# Altium schematic sheet MCU.SchDoc
size A2; SheetNumber: 2; SheetTotal: 2
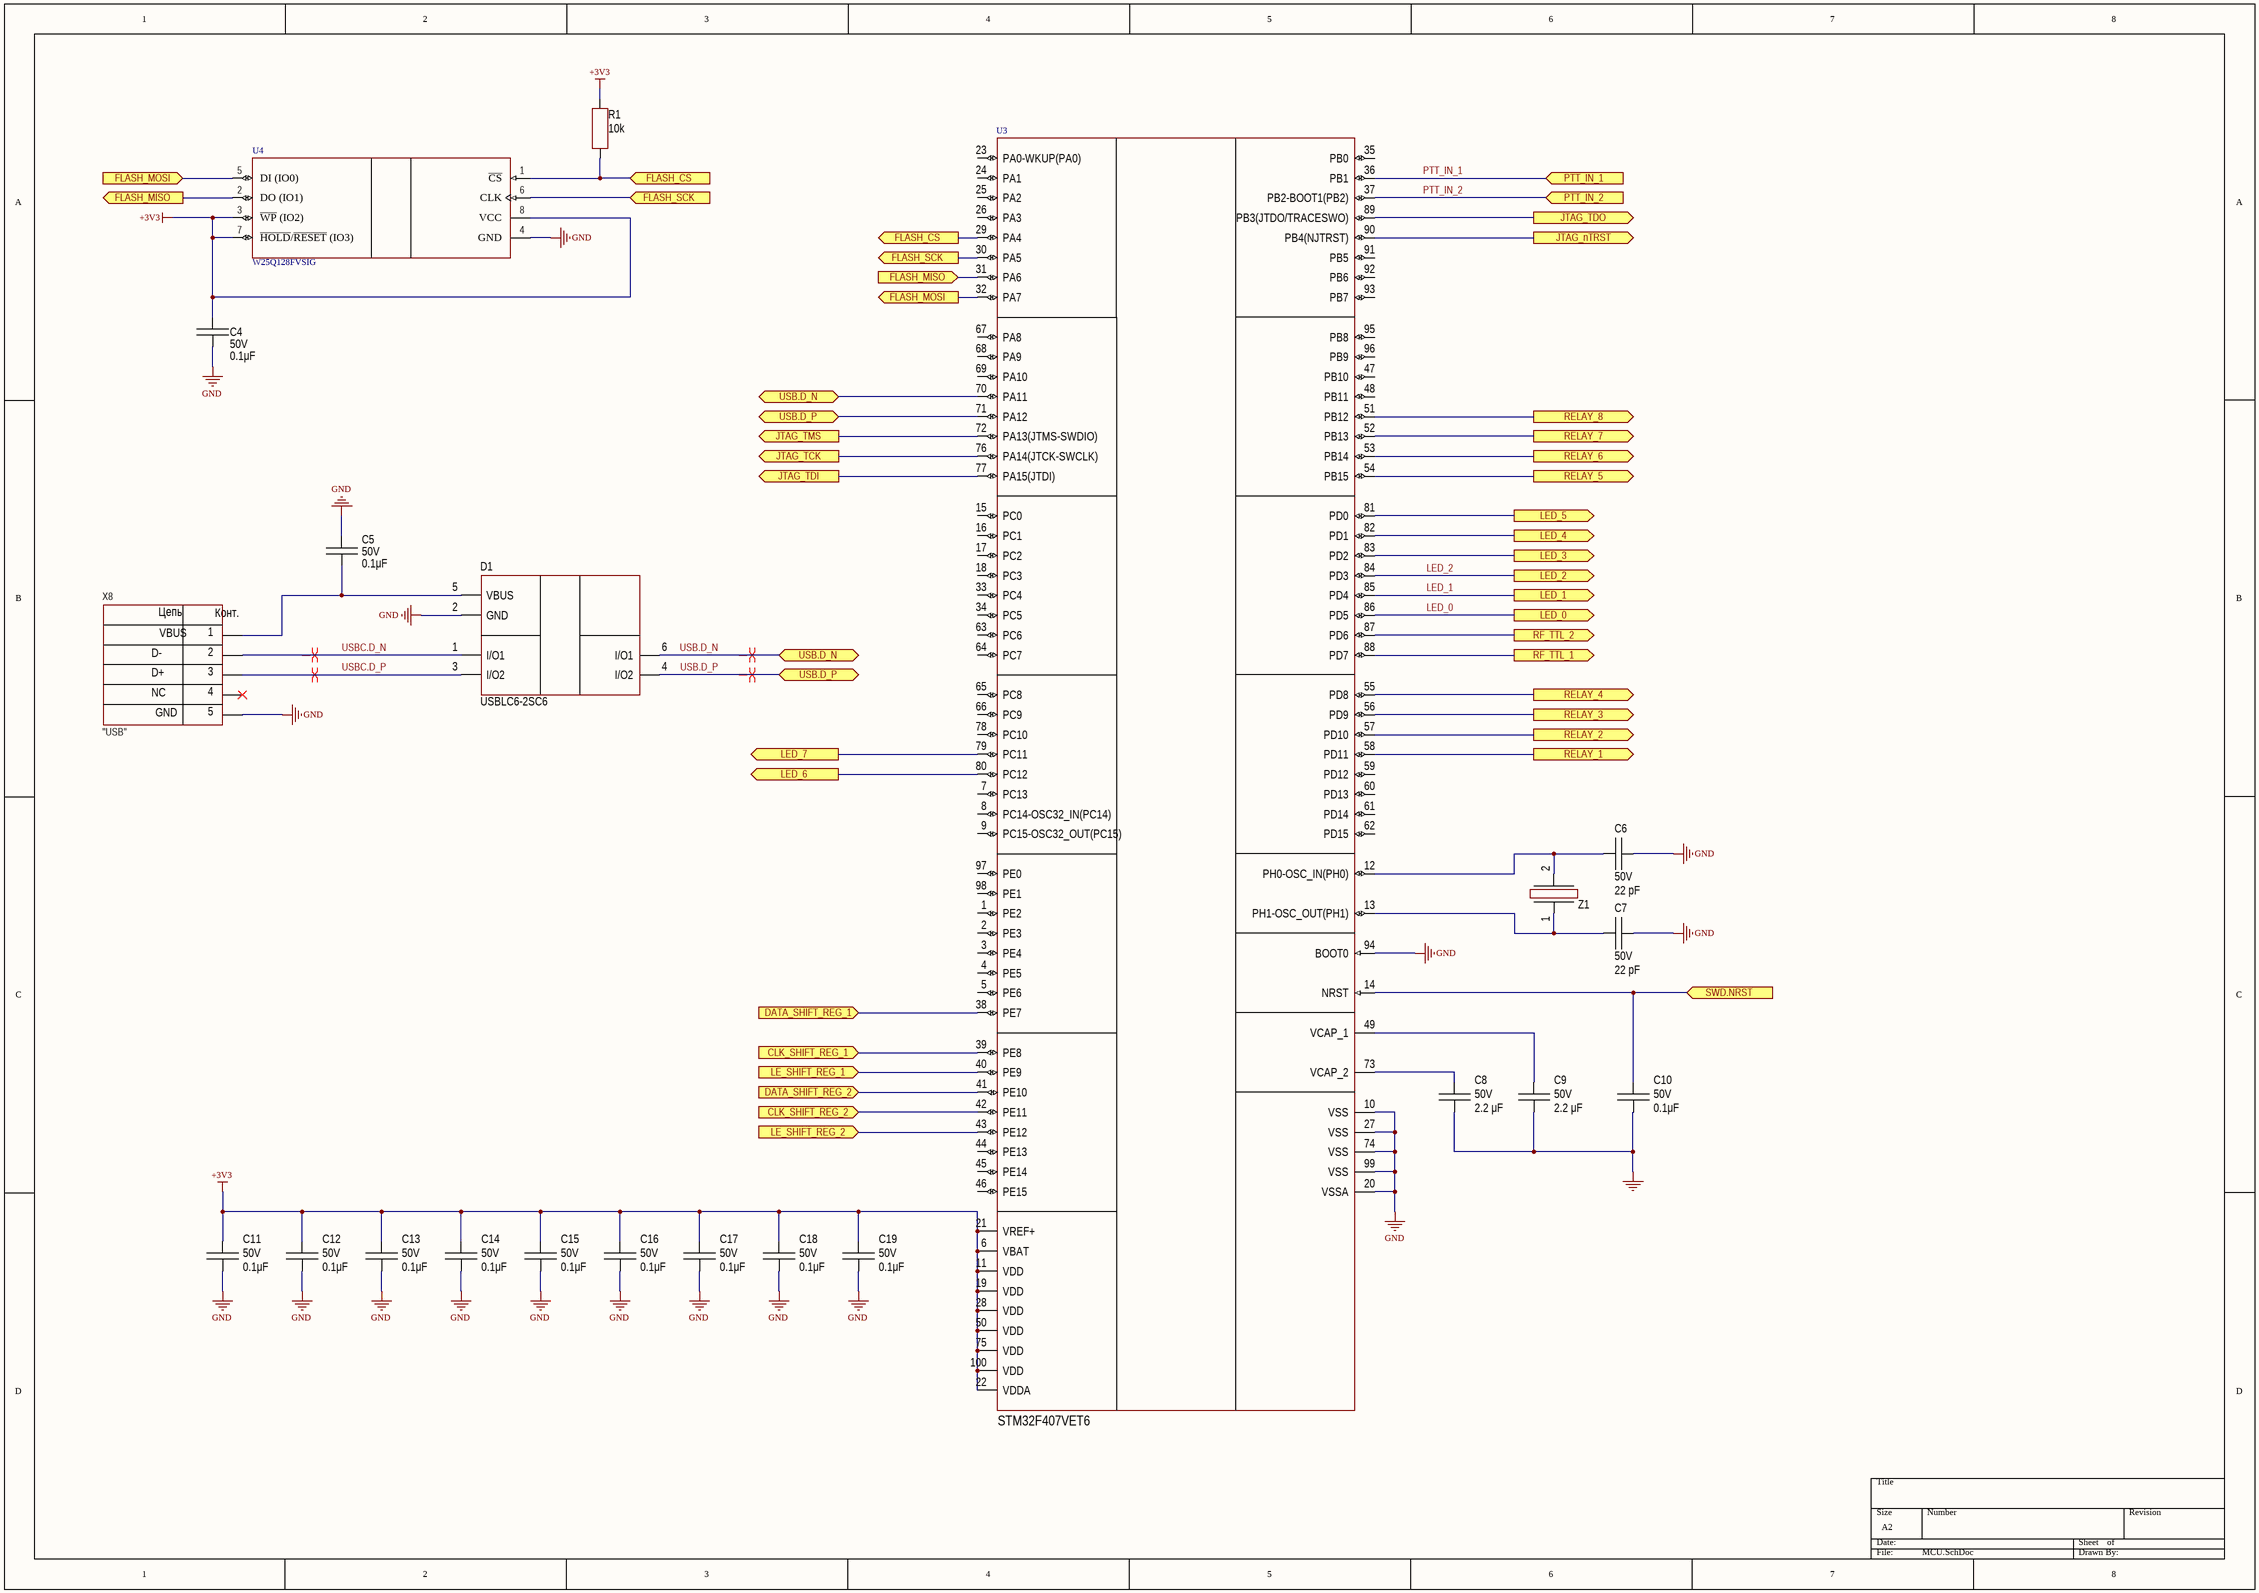
[diagram p0: MCU.SchDoc]

## Parts
C4  value 0.1μF  Voltage: 50V  [CAP: 1206]
C5  value 0.1μF  Voltage: 50V  [CAP: 1206]
C6  value 22 pF  Voltage: 50V  [CAP: 1206]
C7  value 22 pF  Voltage: 50V  [CAP: 1206]
C8  value 2.2 μF  Voltage: 50V  [CAP: 1206]
C9  value 2.2 μF  Voltage: 50V  [CAP: 1206]
C10  value 0.1μF  Voltage: 50V  [CAP: 1206]
C11  value 0.1μF  Voltage: 50V  [CAP: 1206]
C12  value 0.1μF  Voltage: 50V  [CAP: 1206]
C13  value 0.1μF  Voltage: 50V  [CAP: 1206]
C14  value 0.1μF  Voltage: 50V  [CAP: 1206]
C15  value 0.1μF  Voltage: 50V  [CAP: 1206]
C16  value 0.1μF  Voltage: 50V  [CAP: 1206]
C17  value 0.1μF  Voltage: 50V  [CAP: 1206]
C18  value 0.1μF  Voltage: 50V  [CAP: 1206]
C19  value 0.1μF  Voltage: 50V  [CAP: 1206]
D1  (no value)  [SOT23-6]
R1  value 10k  [RES: 1206]
U3  STM32F407VET6  [STM-LQFP100_V]
U4  W25Q128FVSIG  [8-SOIC]
X8  CommentText: "USB"  [CON: 0675031020]
Z1  (no value)  [CTS-ATS-SM-XTAL-2]

## Ports
CLK_SHIFT_REG_1 (in), CLK_SHIFT_REG_2 (in), DATA_SHIFT_REG_1 (in), DATA_SHIFT_REG_2 (in), FLASH_CS (in), FLASH_CS (out), FLASH_MISO (in), FLASH_MISO (out), FLASH_MOSI (in), FLASH_MOSI (out), FLASH_SCK (in), FLASH_SCK (out), JTAG_nTRST (out), JTAG_TCK (out), JTAG_TDI (out), JTAG_TDO (out), JTAG_TMS (out), LE_SHIFT_REG_1 (in), LE_SHIFT_REG_2 (in), LED_0 (out), LED_1 (out), LED_2 (out), LED_3 (out), LED_4 (out), LED_5 (out), LED_6 (out), LED_7 (out), PTT_IN_1 (in), PTT_IN_2 (in), RELAY_1 (out), RELAY_2 (out), RELAY_3 (out), RELAY_4 (out), RELAY_5 (out), RELAY_6 (out), RELAY_7 (out), RELAY_8 (out), RF_TTL_1 (out), RF_TTL_2 (out), SWD.NRST (in), USB.D_N (bidir), USB.D_P (bidir)

## Nets
+3V3: C4.1 C11.2 C12.2 C13.2 C14.2 C15.2 C16.2 C17.2 C18.2 C19.2 R1.1 U3.6(VBAT) U3.11(VDD) U3.19(VDD) U3.21(VREF+) U3.22(VDDA) U3.28(VDD) U3.50(VDD) U3.75(VDD) U3.100(VDD) U4.3(~{WP}_(IO2)) U4.7(~{HOLD}/~{RESET}_(IO3)) U4.8(VCC)
GND: C4.2 C5.1 C6.1 C7.1 C8.1 C9.1 C10.1 C11.1 C12.1 C13.1 C14.1 C15.1 C16.1 C17.1 C18.1 C19.1 D1.2(GND) U3.10(VSS) U3.20(VSSA) U3.27(VSS) U3.74(VSS) U3.94(BOOT0) U3.99(VSS) U4.4(GND) X8.5
CLK_SHIFT_REG_1: U3.39(PE8) ; port CLK_SHIFT_REG_1
CLK_SHIFT_REG_2: U3.42(PE11) ; port CLK_SHIFT_REG_2
DATA_SHIFT_REG_1: U3.38(PE7) ; port DATA_SHIFT_REG_1
DATA_SHIFT_REG_2: U3.41(PE10) ; port DATA_SHIFT_REG_2
FLASH_CS: R1.2 U3.29(PA4) U4.1(~{CS}) ; port FLASH_CS
FLASH_MISO: U3.31(PA6) U4.2(DO_(IO1)) ; port FLASH_MISO
FLASH_MOSI: U3.32(PA7) U4.5(DI_(IO0)) ; port FLASH_MOSI
FLASH_SCK: U3.30(PA5) U4.6(CLK) ; port FLASH_SCK
JTAG_nTRST: U3.90(PB4(NJTRST)) ; port JTAG_nTRST
JTAG_TCK: U3.76(PA14(JTCK-SWCLK)) ; port JTAG_TCK
JTAG_TDI: U3.77(PA15(JTDI)) ; port JTAG_TDI
JTAG_TDO: U3.89(PB3(JTDO/TRACESWO)) ; port JTAG_TDO
JTAG_TMS: U3.72(PA13(JTMS-SWDIO)) ; port JTAG_TMS
LE_SHIFT_REG_1: U3.40(PE9) ; port LE_SHIFT_REG_1
LE_SHIFT_REG_2: U3.43(PE12) ; port LE_SHIFT_REG_2
LED_0: U3.86(PD5) ; port LED_0
LED_1: U3.85(PD4) ; port LED_1
LED_2: U3.84(PD3) ; port LED_2
LED_3: U3.83(PD2) ; port LED_3
LED_4: U3.82(PD1) ; port LED_4
LED_5: U3.81(PD0) ; port LED_5
LED_6: U3.80(PC12) ; port LED_6
LED_7: U3.79(PC11) ; port LED_7
PTT_IN_1: U3.36(PB1) ; port PTT_IN_1
PTT_IN_2: U3.37(PB2-BOOT1(PB2)) ; port PTT_IN_2
RELAY_1: U3.58(PD11) ; port RELAY_1
RELAY_2: U3.57(PD10) ; port RELAY_2
RELAY_3: U3.56(PD9) ; port RELAY_3
RELAY_4: U3.55(PD8) ; port RELAY_4
RELAY_5: U3.54(PB15) ; port RELAY_5
RELAY_6: U3.53(PB14) ; port RELAY_6
RELAY_7: U3.52(PB13) ; port RELAY_7
RELAY_8: U3.51(PB12) ; port RELAY_8
RF_TTL_1: U3.88(PD7) ; port RF_TTL_1
RF_TTL_2: U3.87(PD6) ; port RF_TTL_2
SWD.NRST: C10.2 U3.14(NRST) ; port SWD.NRST
USB.D_N: D1.6(I/O1) U3.70(PA11) ; port USB.D_N
USB.D_P: D1.4(I/O2) U3.71(PA12) ; port USB.D_P
USBC.D_N: D1.1(I/O1) X8.2
USBC.D_P: D1.3(I/O2) X8.3
NetC5_2: C5.2 D1.5(VBUS) X8.1
NetC6_2: C6.2 U3.12(PH0-OSC_IN(PH0)) Z1.2
NetC7_2: C7.2 U3.13(PH1-OSC_OUT(PH1)) Z1.1
NetC8_2: C8.2 U3.73(VCAP_2)
NetC9_2: C9.2 U3.49(VCAP_1)

Not connected (* = marked no-connect by the designer): U3 1(PE2) 2(PE3) 3(PE4) 4(PE5) 5(PE6) 7(PC13) 8(PC14-OSC32_IN(PC14)) 9(PC15-OSC32_OUT(PC15)) 15(PC0) 16(PC1) 17(PC2) 18(PC3) 23(PA0-WKUP(PA0)) 24(PA1) 25(PA2) 26(PA3) 33(PC4) 34(PC5) 35(PB0) 44(PE13) 45(PE14) 46(PE15) 47(PB10) 48(PB11) 59(PD12) 60(PD13) 61(PD14) 62(PD15) 63(PC6) 64(PC7) 65(PC8) 66(PC9) 67(PA8) 68(PA9) 69(PA10) 78(PC10) 91(PB5) 92(PB6) 93(PB7) 95(PB8) 96(PB9) 97(PE0) 98(PE1); X8 4*

## Layout directives
differential pair: USB.D_N, USB.D_P, USBC.D_N, USBC.D_P

## Notes on the sheet
- (in symbol Connector_USB_mini_B) Цепь; Конт.; VBUS; D-; D+; NC; GND

## Library data of the parts
C4 C5 C10-C19 = Ceramic_1206: Manufacturer: Yageo; PartNumber: CC1206KRX7R9BB104; ValueManufacturerPartNumber: Ceramic capacitor, 0.1μF, X7R, ±10%, 50V, 1206, -55...+125°C; TypeCapacitor: Ceramic capacitor; Tolerance: ±10%; TypeDielectric: X7R; Package: 1206; HelpURL: https://www.digikey.com/product-detail/en/yageo/CC1206KRX7R9BB104/311-1179-1-ND/303089; Temperature: -55...+125°C
C6 C7 = Ceramic_1206: Manufacturer: Yageo; PartNumber: CC1206KRX7R9BB104; ValueManufacturerPartNumber: Ceramic capacitor, 22 pF, X7R, ±10%, 50V, 1206, -55...+125°C; TypeCapacitor: Ceramic capacitor; Tolerance: ±10%; TypeDielectric: X7R; Package: 1206; HelpURL: https://www.digikey.com/product-detail/en/yageo/CC1206KRX7R9BB104/311-1179-1-ND/303089; Temperature: -55...+125°C
C8 C9 = Ceramic_1206: Manufacturer: Yageo; PartNumber: CC1206KRX7R9BB104; ValueManufacturerPartNumber: Ceramic capacitor, 2.2 μF, X7R, ±10%, 50V, 1206, -55...+125°C; TypeCapacitor: Ceramic capacitor; Tolerance: ±10%; TypeDielectric: X7R; Package: 1206; HelpURL: https://www.digikey.com/product-detail/en/yageo/CC1206KRX7R9BB104/311-1179-1-ND/303089; Temperature: -55...+125°C
D1 = USBLC6-2SC6: Manufacturer: STMicroelectronics; TypeDiode: USB protection; Current: 5A peak; VoltageDrop: 17V; RecoveryTime: Power line; Package: SOT-23-6; HelpURL: https://www.digikey.com/product-detail/en/stmicroelectronics/USBLC6-2SC6/497-5235-1-ND/1121688; ValueManufacturerPartNumber: =TypeDiode+', '+Voltage+', '+Current+', '+VoltageDrop+', '+RecoveryTime+', '+Package+', '+Temperature; Temperature: -40...+125°C; PartNumber: USBLC6-2SC6
R1 = Resistor_1206: Manufacturer: Yageo; PartNumber: RC1206JR-07100RL; TypeResistor: Resistor film; Power: 0.25W; Package: 1206; HelpURL: https://www.digikey.com/product-detail/en/yageo/RC1206JR-07100RL/311-100ERCT-ND/732153; ValueManufacturerPartNumber: =TypeResistor+', '+Value+', '+Tolerance+', '+Package+', '+Power+', '+Temperature; Temperature: -55...+125°C
U3 = CMP-0243-00016-3: ARM Cortex-M4 32-bit MCU+FPU, 210 DMIPS, 512 kB Flash, 192 kB Internal RAM, 82 I/Os, 100-pin LQFP, -40 to 85 degC, Tray; Manufacturer: STMicroelectronics; Supply Voltage(Vcc) max (V): 3.6; Supply Voltage(Vcc) min (V): 1.8; I/Os (High Current): 82; FLASH Size (Prog) (kB): 512; Operating Frequency(F) (Processor speed) (MHz): 168; D/A Converter: 2x12-bit; Internal RAM Size (kB): 192; PackageReference: LQFP100; Core: ARM Cortex-M4; ComponentLink1URL: http://www.st.com/web/en/home.html; ComponentLink1Description: Manufacturer URL; DatasheetVersion: Rev. 4; Packing: Tray; Mounting Technology: Surface Mount; ComponentLink2Description: Datasheet; ComponentLink2URL: http://www.st.com/st-web-ui/static/active/en/resource/technical/document/datasheet/DM00037051.pdf; ComponentLink3Description: Package Specification; PartNumber: STM32F407VET6; PackageVersion: Rev. 1, 06/2013; PackageDescription: 100-Pin Low Profile Quad Flat Package, 14 x 14 mm Body, 0.5 mm Pitch; ComponentLink3URL: http://www.st.com/st-web-ui/static/active/en/resource/technical/document/data_brief/DM00071938.pdf
U4 = CMP-2000-05005-1: 3V 128M-Bit Serial Flash Memory with Dual/Quad SPI & QPI, 2.7 to 3.6 V, -40 to 85 degC, 8-Pin SOIC, RoHS, Tape and Reel; Manufacturer: Winbond; Number of Words: 16777216; Address Bus: 24b; Word Size: 8b; Boot Type: NotRequired; Supply Current: 20mA; Operating Supply Voltage (Max): 3.6V; Sync/Async: Synchronous; Rad Hardened: No; Interface Type: Serial(SPI); Access Time (Max): 7ns; Operating Supply Voltage (Min): 2.7V; Operating Supply Voltage (Typ): 3/3.3V; Programmable: Yes; Density: 134217728Bit; Cell Type: NOR; Package Description: 8-Pin Small Outline Integrated Circuit, Body 5.28 x 5.28 mm, Pitch 1.27 mm; Datasheet URL: http://download.siliconexpert.com/pdfs/2015/11/30/6/42/17/890/win_/manual/3w25q128fv20rev.l2008242015.pdf; Package Reference: SS-8; Package Type: SOICW; Datasheet Version: Rev. L, 08/2015; Manufacturer URL: http://www.winbond.com/hq/index.html?__locale=en; Pin Count: 8; Operating Temperature Classification: Industrial; Operating Temperature (Min): -40C; Program/Erase Volt (Typ): 2.7to3.6V; Operating Temperature (Max): 85C; Mounting: SurfaceMount; Operating Temp Range: -40Cto85C
X8 = Connector_USB_mini_B: Manufacturer: Molex; ValueManufacturerPartNumber: USB mini B; PartNumber: 0675031020; HelpURL: https://www.digikey.com/product-detail/en/molex/0675031020/WM5461CT-ND/1624427; TypeConnector: USB mini B
Z1 = Crystal_3215: Manufacturer: Epson; PartNumber: FC-135 32.7680KA-A5; LoadCapacitance: 12.5pF; Tolerance: ±20ppm; Package: case 3215; HelpURL: https://www.digikey.com/product-detail/en/epson/FC-135-32.7680KA-A5/SER4103CT-ND/6188447; ValueManufacturerPartNumber: =TypeOscilator+', '+Frequency+', '+LoadCapacitance+', '+Tolerance+', '+Package+', '+Temperature; Temperature: -40...+85°C; TypeOscilator: Crystal